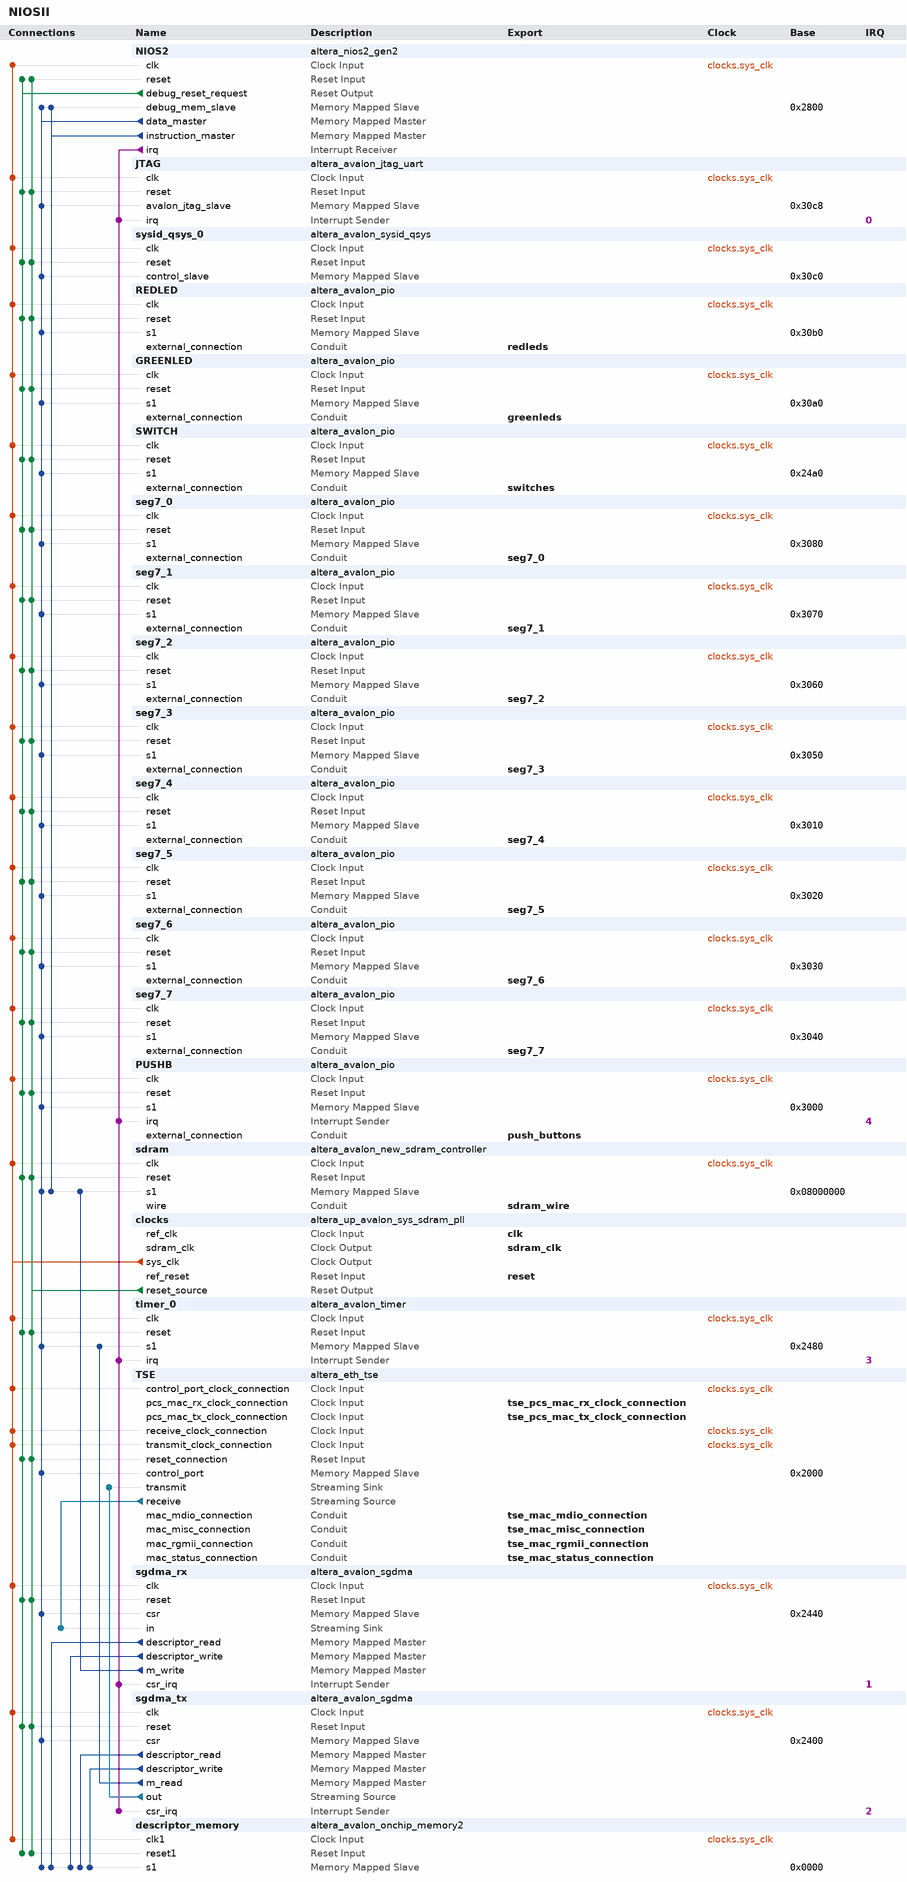
[diagram p0: system contents]
# Platform Designer (Qsys) system NIOSII, Cyclone IV E EP4CE115F29C7
# Parameters at their usual value, and those the tool derives, are not listed.
package require -exact qsys 17.1
create_system NIOSII
set_project_property DEVICE_FAMILY {Cyclone IV E}
set_project_property DEVICE EP4CE115F29C7

add_instance NIOS2 altera_nios2_gen2 17.1
set_instance_parameter_value NIOS2 dcache_size 2048
set_instance_parameter_value NIOS2 exceptionSlave sdram.s1
set_instance_parameter_value NIOS2 icache_size 4096
set_instance_parameter_value NIOS2 impl Fast
set_instance_parameter_value NIOS2 resetSlave sdram.s1

add_instance JTAG altera_avalon_jtag_uart 17.1
set_instance_parameter_value JTAG simInteractiveOptions NO_INTERACTIVE_WINDOWS

add_instance sysid_qsys_0 altera_avalon_sysid_qsys 17.1
set_instance_parameter_value sysid_qsys_0 id 0

add_instance REDLED altera_avalon_pio 17.1
set_instance_parameter_value REDLED direction Output
set_instance_parameter_value REDLED width 18

add_instance GREENLED altera_avalon_pio 17.1
set_instance_parameter_value GREENLED direction Output
set_instance_parameter_value GREENLED width 9

add_instance SWITCH altera_avalon_pio 17.1
set_instance_parameter_value SWITCH direction Input
set_instance_parameter_value SWITCH width 18

add_instance seg7_0 altera_avalon_pio 17.1
set_instance_parameter_value seg7_0 direction Output
set_instance_parameter_value seg7_0 width 7

add_instance seg7_1 altera_avalon_pio 17.1
set_instance_parameter_value seg7_1 direction Output
set_instance_parameter_value seg7_1 width 7

add_instance seg7_2 altera_avalon_pio 17.1
set_instance_parameter_value seg7_2 direction Output
set_instance_parameter_value seg7_2 width 7

add_instance seg7_3 altera_avalon_pio 17.1
set_instance_parameter_value seg7_3 direction Output
set_instance_parameter_value seg7_3 width 7

add_instance seg7_4 altera_avalon_pio 17.1
set_instance_parameter_value seg7_4 direction Output
set_instance_parameter_value seg7_4 width 7

add_instance seg7_5 altera_avalon_pio 17.1
set_instance_parameter_value seg7_5 direction Output
set_instance_parameter_value seg7_5 width 7

add_instance seg7_6 altera_avalon_pio 17.1
set_instance_parameter_value seg7_6 direction Output
set_instance_parameter_value seg7_6 width 7

add_instance seg7_7 altera_avalon_pio 17.1
set_instance_parameter_value seg7_7 direction Output
set_instance_parameter_value seg7_7 width 7

add_instance PUSHB altera_avalon_pio 17.1
set_instance_parameter_value PUSHB captureEdge true
set_instance_parameter_value PUSHB direction Input
set_instance_parameter_value PUSHB edgeType FALLING
set_instance_parameter_value PUSHB generateIRQ true
set_instance_parameter_value PUSHB irqType EDGE
set_instance_parameter_value PUSHB width 4

add_instance sdram altera_avalon_new_sdram_controller 17.1
set_instance_parameter_value sdram TAC 5.4
set_instance_parameter_value sdram TRCD 15.0
set_instance_parameter_value sdram TRP 15.0
set_instance_parameter_value sdram casLatency 3
set_instance_parameter_value sdram columnWidth 10
set_instance_parameter_value sdram dataWidth 32
set_instance_parameter_value sdram generateSimulationModel false
set_instance_parameter_value sdram model single_Micron_MT48LC4M32B2_7_chip
set_instance_parameter_value sdram numberOfBanks 4
set_instance_parameter_value sdram numberOfChipSelects 1
set_instance_parameter_value sdram powerUpDelay 100.0
set_instance_parameter_value sdram refreshPeriod 7.8125
set_instance_parameter_value sdram rowWidth 13

add_instance clocks altera_up_avalon_sys_sdram_pll 17.1
set_instance_parameter_value clocks CV_boards DE10-Standard
set_instance_parameter_value clocks gui_outclk 50.0
set_instance_parameter_value clocks gui_refclk 50.0

add_instance timer_0 altera_avalon_timer 17.1
set_instance_parameter_value timer_0 period 1
set_instance_parameter_value timer_0 periodUnits MSEC

add_instance TSE altera_eth_tse 17.1
set_instance_parameter_value TSE XCVR_RCFG_JTAG_ENABLE 0
set_instance_parameter_value TSE XCVR_SET_CAPABILITY_REG_ENABLE 0
set_instance_parameter_value TSE XCVR_SET_CSR_SOFT_LOGIC_ENABLE 0
set_instance_parameter_value TSE XCVR_SET_PRBS_SOFT_LOGIC_ENABLE 0
set_instance_parameter_value TSE XCVR_SET_USER_IDENTIFIER 0
set_instance_parameter_value TSE core_variation MAC_ONLY
set_instance_parameter_value TSE enable_hd_logic true
set_instance_parameter_value TSE enable_mac_flow_ctrl false
set_instance_parameter_value TSE enable_magic_detect true
set_instance_parameter_value TSE enable_shift16 true
set_instance_parameter_value TSE ifGMII RGMII
set_instance_parameter_value TSE ing_addr 11
set_instance_parameter_value TSE mdio_clk_div 40
set_instance_parameter_value TSE stat_cnt_ena true
set_instance_parameter_value TSE transceiver_type NONE

add_instance sgdma_rx altera_avalon_sgdma 17.1
set_instance_parameter_value sgdma_rx enableBurstTransfers false
set_instance_parameter_value sgdma_rx enableUnalignedTransfers false
set_instance_parameter_value sgdma_rx readBlockDataWidth 32
set_instance_parameter_value sgdma_rx sinkErrorWidth 6
set_instance_parameter_value sgdma_rx sourceErrorWidth 0
set_instance_parameter_value sgdma_rx transferMode STREAM_TO_MEMORY
set_instance_parameter_value sgdma_rx writeBurstcountWidth 4

add_instance sgdma_tx altera_avalon_sgdma 17.1
set_instance_parameter_value sgdma_tx enableBurstTransfers false
set_instance_parameter_value sgdma_tx enableUnalignedTransfers false
set_instance_parameter_value sgdma_tx readBlockDataWidth 32
set_instance_parameter_value sgdma_tx sinkErrorWidth 0
set_instance_parameter_value sgdma_tx sourceErrorWidth 1
set_instance_parameter_value sgdma_tx transferMode MEMORY_TO_STREAM
set_instance_parameter_value sgdma_tx writeBurstcountWidth 4

add_instance descriptor_memory altera_avalon_onchip_memory2 17.1
set_instance_parameter_value descriptor_memory dataWidth 32
set_instance_parameter_value descriptor_memory dualPort false
set_instance_parameter_value descriptor_memory initMemContent true
set_instance_parameter_value descriptor_memory initializationFileName onchip_mem.hex
set_instance_parameter_value descriptor_memory memorySize 4096

# connections
add_connection clocks.sys_clk descriptor_memory.clk1 clock
add_connection clocks.sys_clk GREENLED.clk clock
add_connection clocks.sys_clk JTAG.clk clock
add_connection clocks.sys_clk NIOS2.clk clock
add_connection clocks.sys_clk PUSHB.clk clock
add_connection clocks.sys_clk REDLED.clk clock
add_connection clocks.sys_clk sdram.clk clock
add_connection clocks.sys_clk seg7_0.clk clock
add_connection clocks.sys_clk seg7_1.clk clock
add_connection clocks.sys_clk seg7_2.clk clock
add_connection clocks.sys_clk seg7_3.clk clock
add_connection clocks.sys_clk seg7_4.clk clock
add_connection clocks.sys_clk seg7_5.clk clock
add_connection clocks.sys_clk seg7_6.clk clock
add_connection clocks.sys_clk seg7_7.clk clock
add_connection clocks.sys_clk sgdma_rx.clk clock
add_connection clocks.sys_clk sgdma_tx.clk clock
add_connection clocks.sys_clk SWITCH.clk clock
add_connection clocks.sys_clk sysid_qsys_0.clk clock
add_connection clocks.sys_clk timer_0.clk clock
add_connection clocks.sys_clk TSE.control_port_clock_connection clock
add_connection clocks.sys_clk TSE.receive_clock_connection clock
add_connection clocks.sys_clk TSE.transmit_clock_connection clock
add_connection clocks.reset_source descriptor_memory.reset1 reset
add_connection clocks.reset_source GREENLED.reset reset
add_connection clocks.reset_source JTAG.reset reset
add_connection clocks.reset_source NIOS2.reset reset
add_connection clocks.reset_source PUSHB.reset reset
add_connection clocks.reset_source REDLED.reset reset
add_connection clocks.reset_source sdram.reset reset
add_connection clocks.reset_source seg7_0.reset reset
add_connection clocks.reset_source seg7_1.reset reset
add_connection clocks.reset_source seg7_2.reset reset
add_connection clocks.reset_source seg7_3.reset reset
add_connection clocks.reset_source seg7_4.reset reset
add_connection clocks.reset_source seg7_5.reset reset
add_connection clocks.reset_source seg7_6.reset reset
add_connection clocks.reset_source seg7_7.reset reset
add_connection clocks.reset_source sgdma_rx.reset reset
add_connection clocks.reset_source sgdma_tx.reset reset
add_connection clocks.reset_source SWITCH.reset reset
add_connection clocks.reset_source sysid_qsys_0.reset reset
add_connection clocks.reset_source timer_0.reset reset
add_connection clocks.reset_source TSE.reset_connection reset
add_connection NIOS2.debug_reset_request descriptor_memory.reset1 reset
add_connection NIOS2.debug_reset_request GREENLED.reset reset
add_connection NIOS2.debug_reset_request JTAG.reset reset
add_connection NIOS2.debug_reset_request NIOS2.reset reset
add_connection NIOS2.debug_reset_request PUSHB.reset reset
add_connection NIOS2.debug_reset_request REDLED.reset reset
add_connection NIOS2.debug_reset_request sdram.reset reset
add_connection NIOS2.debug_reset_request seg7_0.reset reset
add_connection NIOS2.debug_reset_request seg7_1.reset reset
add_connection NIOS2.debug_reset_request seg7_2.reset reset
add_connection NIOS2.debug_reset_request seg7_3.reset reset
add_connection NIOS2.debug_reset_request seg7_4.reset reset
add_connection NIOS2.debug_reset_request seg7_5.reset reset
add_connection NIOS2.debug_reset_request seg7_6.reset reset
add_connection NIOS2.debug_reset_request seg7_7.reset reset
add_connection NIOS2.debug_reset_request sgdma_rx.reset reset
add_connection NIOS2.debug_reset_request sgdma_tx.reset reset
add_connection NIOS2.debug_reset_request SWITCH.reset reset
add_connection NIOS2.debug_reset_request sysid_qsys_0.reset reset
add_connection NIOS2.debug_reset_request timer_0.reset reset
add_connection NIOS2.debug_reset_request TSE.reset_connection reset
add_connection NIOS2.data_master descriptor_memory.s1 avalon
set_connection_parameter_value NIOS2.data_master/descriptor_memory.s1 baseAddress 0x0000
add_connection NIOS2.data_master GREENLED.s1 avalon
set_connection_parameter_value NIOS2.data_master/GREENLED.s1 baseAddress 0x30a0
add_connection NIOS2.data_master JTAG.avalon_jtag_slave avalon
set_connection_parameter_value NIOS2.data_master/JTAG.avalon_jtag_slave baseAddress 0x30c8
add_connection NIOS2.data_master NIOS2.debug_mem_slave avalon
set_connection_parameter_value NIOS2.data_master/NIOS2.debug_mem_slave baseAddress 0x2800
add_connection NIOS2.data_master PUSHB.s1 avalon
set_connection_parameter_value NIOS2.data_master/PUSHB.s1 baseAddress 0x3000
add_connection NIOS2.data_master REDLED.s1 avalon
set_connection_parameter_value NIOS2.data_master/REDLED.s1 baseAddress 0x30b0
add_connection NIOS2.data_master sdram.s1 avalon
set_connection_parameter_value NIOS2.data_master/sdram.s1 baseAddress 0x08000000
add_connection NIOS2.data_master seg7_0.s1 avalon
set_connection_parameter_value NIOS2.data_master/seg7_0.s1 baseAddress 0x3080
add_connection NIOS2.data_master seg7_1.s1 avalon
set_connection_parameter_value NIOS2.data_master/seg7_1.s1 baseAddress 0x3070
add_connection NIOS2.data_master seg7_2.s1 avalon
set_connection_parameter_value NIOS2.data_master/seg7_2.s1 baseAddress 0x3060
add_connection NIOS2.data_master seg7_3.s1 avalon
set_connection_parameter_value NIOS2.data_master/seg7_3.s1 baseAddress 0x3050
add_connection NIOS2.data_master seg7_4.s1 avalon
set_connection_parameter_value NIOS2.data_master/seg7_4.s1 baseAddress 0x3010
add_connection NIOS2.data_master seg7_5.s1 avalon
set_connection_parameter_value NIOS2.data_master/seg7_5.s1 baseAddress 0x3020
add_connection NIOS2.data_master seg7_6.s1 avalon
set_connection_parameter_value NIOS2.data_master/seg7_6.s1 baseAddress 0x3030
add_connection NIOS2.data_master seg7_7.s1 avalon
set_connection_parameter_value NIOS2.data_master/seg7_7.s1 baseAddress 0x3040
add_connection NIOS2.data_master sgdma_rx.csr avalon
set_connection_parameter_value NIOS2.data_master/sgdma_rx.csr baseAddress 0x2440
add_connection NIOS2.data_master sgdma_tx.csr avalon
set_connection_parameter_value NIOS2.data_master/sgdma_tx.csr baseAddress 0x2400
add_connection NIOS2.data_master SWITCH.s1 avalon
set_connection_parameter_value NIOS2.data_master/SWITCH.s1 baseAddress 0x24a0
add_connection NIOS2.data_master sysid_qsys_0.control_slave avalon
set_connection_parameter_value NIOS2.data_master/sysid_qsys_0.control_slave baseAddress 0x30c0
add_connection NIOS2.data_master timer_0.s1 avalon
set_connection_parameter_value NIOS2.data_master/timer_0.s1 baseAddress 0x2480
add_connection NIOS2.data_master TSE.control_port avalon
set_connection_parameter_value NIOS2.data_master/TSE.control_port baseAddress 0x2000
add_connection NIOS2.instruction_master NIOS2.debug_mem_slave avalon
set_connection_parameter_value NIOS2.instruction_master/NIOS2.debug_mem_slave baseAddress 0x2800
add_connection NIOS2.instruction_master sdram.s1 avalon
set_connection_parameter_value NIOS2.instruction_master/sdram.s1 baseAddress 0x08000000
add_connection sgdma_rx.descriptor_read descriptor_memory.s1 avalon
set_connection_parameter_value sgdma_rx.descriptor_read/descriptor_memory.s1 baseAddress 0x0000
add_connection sgdma_rx.descriptor_write descriptor_memory.s1 avalon
set_connection_parameter_value sgdma_rx.descriptor_write/descriptor_memory.s1 baseAddress 0x0000
add_connection sgdma_rx.m_write sdram.s1 avalon
set_connection_parameter_value sgdma_rx.m_write/sdram.s1 baseAddress 0x08000000
add_connection sgdma_tx.descriptor_read descriptor_memory.s1 avalon
set_connection_parameter_value sgdma_tx.descriptor_read/descriptor_memory.s1 baseAddress 0x0000
add_connection sgdma_tx.descriptor_write descriptor_memory.s1 avalon
set_connection_parameter_value sgdma_tx.descriptor_write/descriptor_memory.s1 baseAddress 0x0000
add_connection sgdma_tx.m_read timer_0.s1 avalon
set_connection_parameter_value sgdma_tx.m_read/timer_0.s1 baseAddress 0x2480
add_connection sgdma_tx.out TSE.transmit avalon_streaming
add_connection TSE.receive sgdma_rx.in avalon_streaming
add_connection NIOS2.irq JTAG.irq interrupt
set_connection_parameter_value NIOS2.irq/JTAG.irq irqNumber 0
add_connection NIOS2.irq PUSHB.irq interrupt
set_connection_parameter_value NIOS2.irq/PUSHB.irq irqNumber 4
add_connection NIOS2.irq sgdma_rx.csr_irq interrupt
set_connection_parameter_value NIOS2.irq/sgdma_rx.csr_irq irqNumber 1
add_connection NIOS2.irq sgdma_tx.csr_irq interrupt
set_connection_parameter_value NIOS2.irq/sgdma_tx.csr_irq irqNumber 2
add_connection NIOS2.irq timer_0.irq interrupt
set_connection_parameter_value NIOS2.irq/timer_0.irq irqNumber 3

# exported interfaces
add_interface clk clock sink
set_interface_property clk EXPORT_OF clocks.ref_clk
add_interface greenleds conduit end
set_interface_property greenleds EXPORT_OF GREENLED.external_connection
add_interface push_buttons conduit end
set_interface_property push_buttons EXPORT_OF PUSHB.external_connection
add_interface redleds conduit end
set_interface_property redleds EXPORT_OF REDLED.external_connection
add_interface reset reset sink
set_interface_property reset EXPORT_OF clocks.ref_reset
add_interface sdram_clk clock source
set_interface_property sdram_clk EXPORT_OF clocks.sdram_clk
add_interface sdram_wire conduit end
set_interface_property sdram_wire EXPORT_OF sdram.wire
add_interface seg7_0 conduit end
set_interface_property seg7_0 EXPORT_OF seg7_0.external_connection
add_interface seg7_1 conduit end
set_interface_property seg7_1 EXPORT_OF seg7_1.external_connection
add_interface seg7_2 conduit end
set_interface_property seg7_2 EXPORT_OF seg7_2.external_connection
add_interface seg7_3 conduit end
set_interface_property seg7_3 EXPORT_OF seg7_3.external_connection
add_interface seg7_4 conduit end
set_interface_property seg7_4 EXPORT_OF seg7_4.external_connection
add_interface seg7_5 conduit end
set_interface_property seg7_5 EXPORT_OF seg7_5.external_connection
add_interface seg7_6 conduit end
set_interface_property seg7_6 EXPORT_OF seg7_6.external_connection
add_interface seg7_7 conduit end
set_interface_property seg7_7 EXPORT_OF seg7_7.external_connection
add_interface switches conduit end
set_interface_property switches EXPORT_OF SWITCH.external_connection
add_interface tse_mac_mdio_connection conduit end
set_interface_property tse_mac_mdio_connection EXPORT_OF TSE.mac_mdio_connection
add_interface tse_mac_misc_connection conduit end
set_interface_property tse_mac_misc_connection EXPORT_OF TSE.mac_misc_connection
add_interface tse_mac_rgmii_connection conduit end
set_interface_property tse_mac_rgmii_connection EXPORT_OF TSE.mac_rgmii_connection
add_interface tse_mac_status_connection conduit end
set_interface_property tse_mac_status_connection EXPORT_OF TSE.mac_status_connection
add_interface tse_pcs_mac_rx_clock_connection clock sink
set_interface_property tse_pcs_mac_rx_clock_connection EXPORT_OF TSE.pcs_mac_rx_clock_connection
add_interface tse_pcs_mac_tx_clock_connection clock sink
set_interface_property tse_pcs_mac_tx_clock_connection EXPORT_OF TSE.pcs_mac_tx_clock_connection

set_interconnect_requirement {$system} qsys_mm.clockCrossingAdapter HANDSHAKE
set_interconnect_requirement {$system} qsys_mm.enableEccProtection FALSE
set_interconnect_requirement {$system} qsys_mm.insertDefaultSlave FALSE
set_interconnect_requirement {$system} qsys_mm.maxAdditionalLatency 1

save_system NIOSII.qsys
